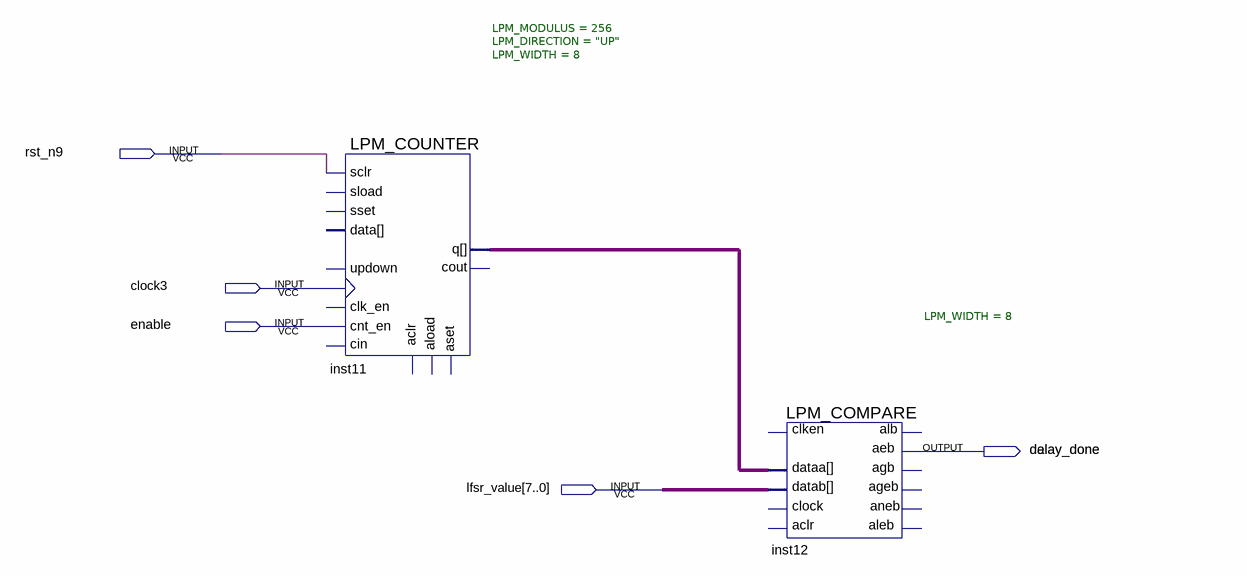
[diagram p0: schematic sheet]
// Quartus schematic contador_delay.bdf as structural Verilog: 2 symbols, 5 pins
module contador_delay (
  input  rst_n9,
  input  clock3,
  input  enable,
  input  [7:0] lfsr_value,
  output delay_done
);

  wire [7:0] inst11_q;

  LPM_COUNTER #(.LPM_MODULUS(256), .LPM_DIRECTION("UP"), .LPM_WIDTH(8)) inst11 (
    .clock(clock3), .cnt_en(enable), .sclr(rst_n9), .q(inst11_q));  // open: sload, data, clk_en, aload, aclr, aset, cin, sset, updown, cout
  LPM_COMPARE #(.LPM_WIDTH(8)) inst12 (
    .dataa(inst11_q), .datab(lfsr_value), .aeb(delay_done));  // open: clock, aclr, clken, aleb, agb, aneb, ageb, alb
endmodule
